# EAGLE design main (EAGLE 9.6.2)
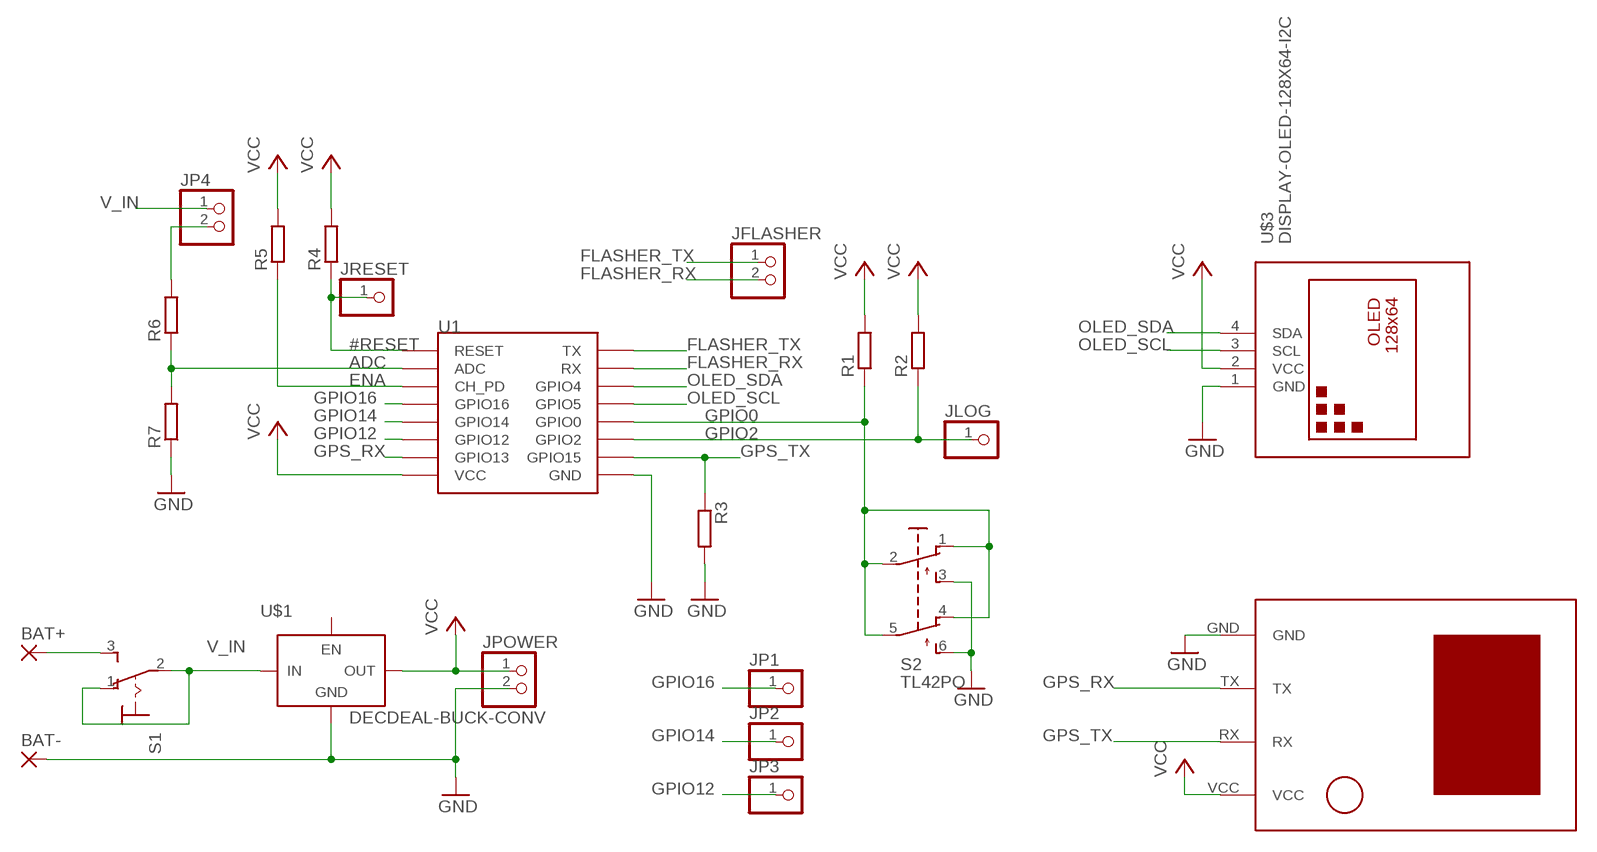
[diagram p0: schematic, sheet 1]

## Parts
BAT+  3,17/1,3  [3,17/1,3]
BAT-  3,17/1,3  [3,17/1,3]
JFLASHER  PINHD-1X2  [1X02]
JLOG  PINHD-1X1  [1X01]
JP1  PINHD-1X1  [1X01]
JP2  PINHD-1X1  [1X01]
JP3  PINHD-1X1  [1X01]
JP4  PINHD-1X2  [1X02]
JPOWER  PINHD-1X2  [1X02]
JRESET  PINHD-1X1  [1X01]
R1  R-EU_0207/10  [0207/10]
R2  R-EU_0207/10  [0207/10]
R3  R-EU_0309/V  [0309V]
R4  R-EU_0207/10  [0207/10]
R5  R-EU_0207/10  [0207/10]
R6  R-EU_0207/10  [0207/10]
R7  R-EU_0207/10  [0207/10]
S1  M9040P  [M9040P]
S2  TL42PO  [TL4XPO]
U1  ESP12  [ESP12]
U$1  DECDEAL-BUCK-CONV  [DECDEAL-BUCK-CONV]
U$2  U-BLOX-NEO6V2  [U-BLOX-NEO6V2]
U$3  DISPLAY-OLED-128X64-I2C  [DISPLAY-OLED-128X64-I2C]

## Nets
#RESET: JRESET.1 R4.1 U1.RESET
ADC: R6.1 R7.2 U1.ADC
BAT+: BAT+.1(P) S1.3(S)
ENA: R5.1 U1.CH_PD
FLASHER_RX: JFLASHER.2 U1.RX
FLASHER_TX: JFLASHER.1 U1.TX
GND: BAT-.1(P) JPOWER.2 R3.2 R7.1 S2.3(S) S2.6(S1) U1.GND U$1.GND U$2.GND U$3.1(GND)
GPIO0: R1.1 S2.1(O) S2.2(P) S2.4(O1) S2.5(P1) U1.GPIO0
GPIO2: JLOG.1 R2.1 U1.GPIO2
GPIO12: JP3.1 U1.GPIO12
GPIO14: JP2.1 U1.GPIO14
GPIO16: JP1.1 U1.GPIO16
GPS_RX: U1.GPIO13 U$2.TX
GPS_TX: R3.1 U1.GPIO15 U$2.RX
N$186: JP4.2 R6.2
OLED_SCL: U1.GPIO5 U$3.3(SCL)
OLED_SDA: U1.GPIO4 U$3.4(SDA)
V_IN: JP4.1 S1.1(O) S1.2(P) U$1.IN
VCC: JPOWER.1 R1.2 R2.2 R4.2 R5.2 U1.VCC U$1.OUT U$2.VCC U$3.2(VCC)
Unconnected: U$1.EN

## Library data of the parts
BAT+ BAT- = wirepad:3,17/1,3: THROUGH-HOLE PAD
JFLASHER JP4 JPOWER = pinhead:PINHD-1X2: PIN HEADER
JLOG JP1-JP3 JRESET = pinhead:PINHD-1X1: PIN HEADER
R1-R7 = rcl:R-EU_: RESISTOR, European symbol; SPICEPREFIX: R
S1 = switch:M9040P: TOGGLE SWITCH Marquardt
S2 = switch:TL42PO: TINY SWITCH ON - MOM Source: http://www2.produktinfo.conrad.com/datenblaetter/700000-724999/705152-da-01-de-Subminiaturschalter_TL_36YO.pdf
U1 = esp8266modules:ESP12: ESP8266 Wifi module 12
U$1 = gsimon75:DECDEAL-BUCK-CONV: DecDeal DC-DC Buck Converter (4.5 .. 24 V) to (1.8 .. 12 V) @ 3A Step-Down Power Module 97.5% Efficiency
U$2 = u-blox neo-6m v2:U-BLOX-NEO6V2
U$3 = diy-modules:DISPLAY-OLED-128X64-I2C: 128x64 Dot Matrix OLED Module based on SSD1306 chip Variant with I2C interface More details available here: http://www.instructables.com/id/Monochrome-096-i2c-OLED-display-with-arduino-SSD13/ SSD1306 datasheet: https://cdn-shop.adafruit.com/datasheets/SSD1306.pdf Click here to find device on ebay.com <http://www.ebay.com/sch/oled+display+128x64+iic> Note: There are two variants: I2C and SPI. Search for the proper version.

## Board
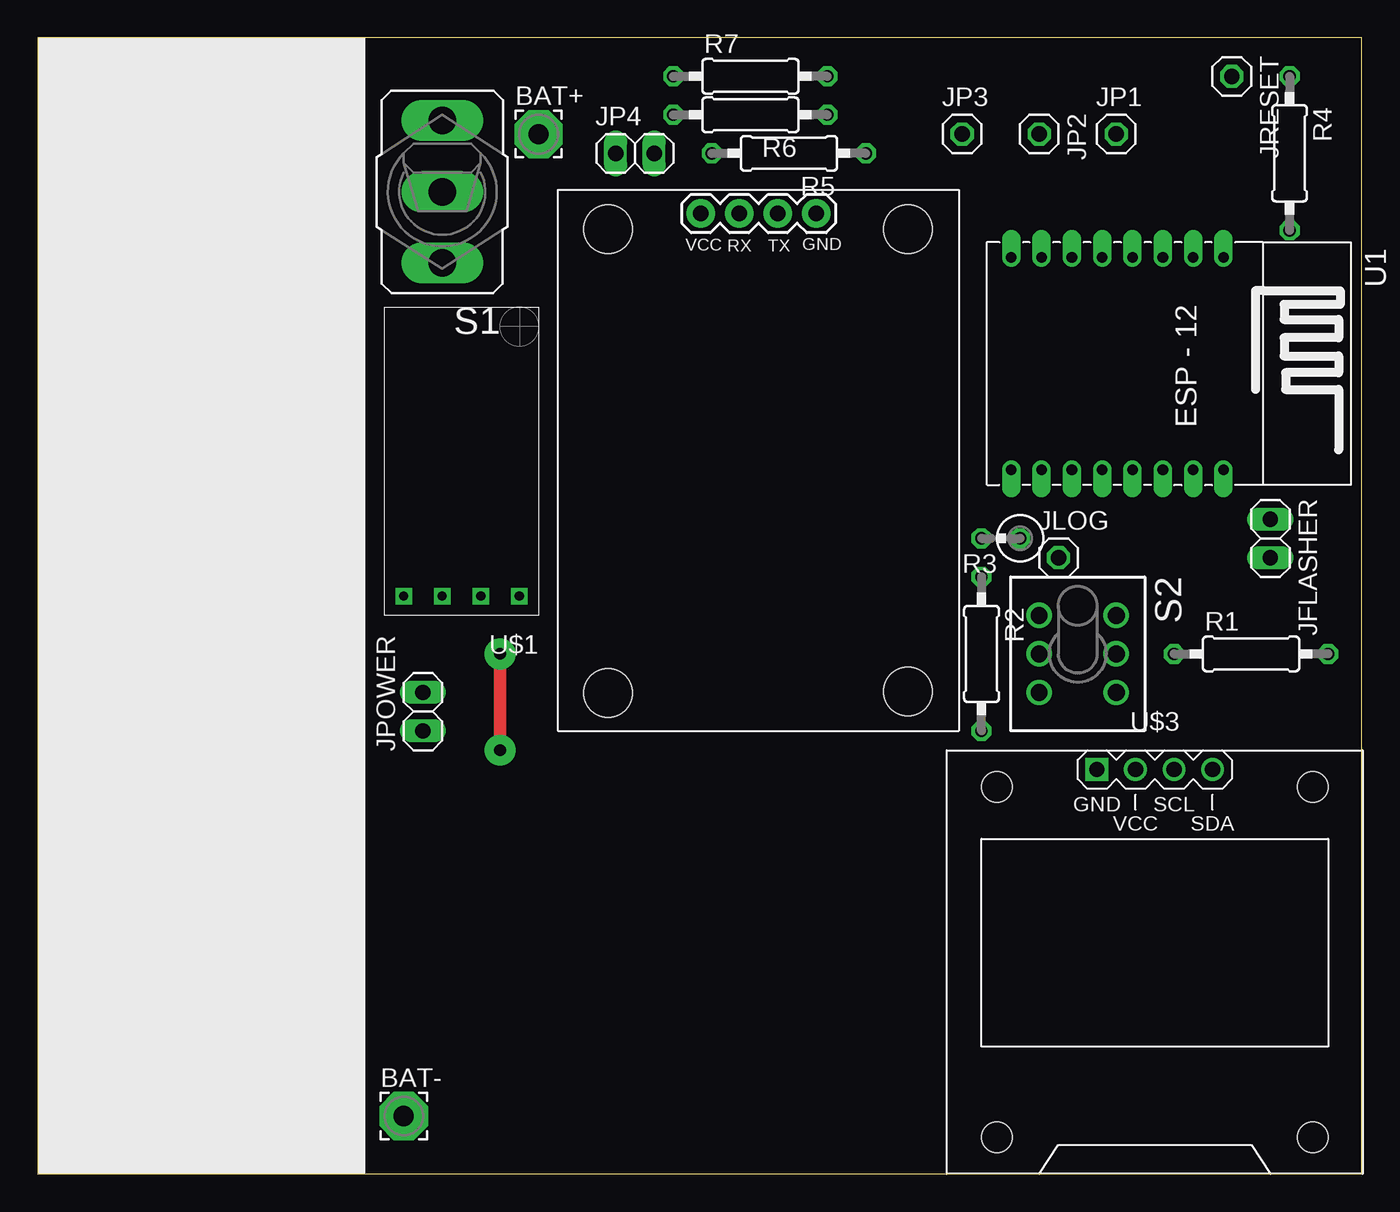
[diagram p1: board, top side]
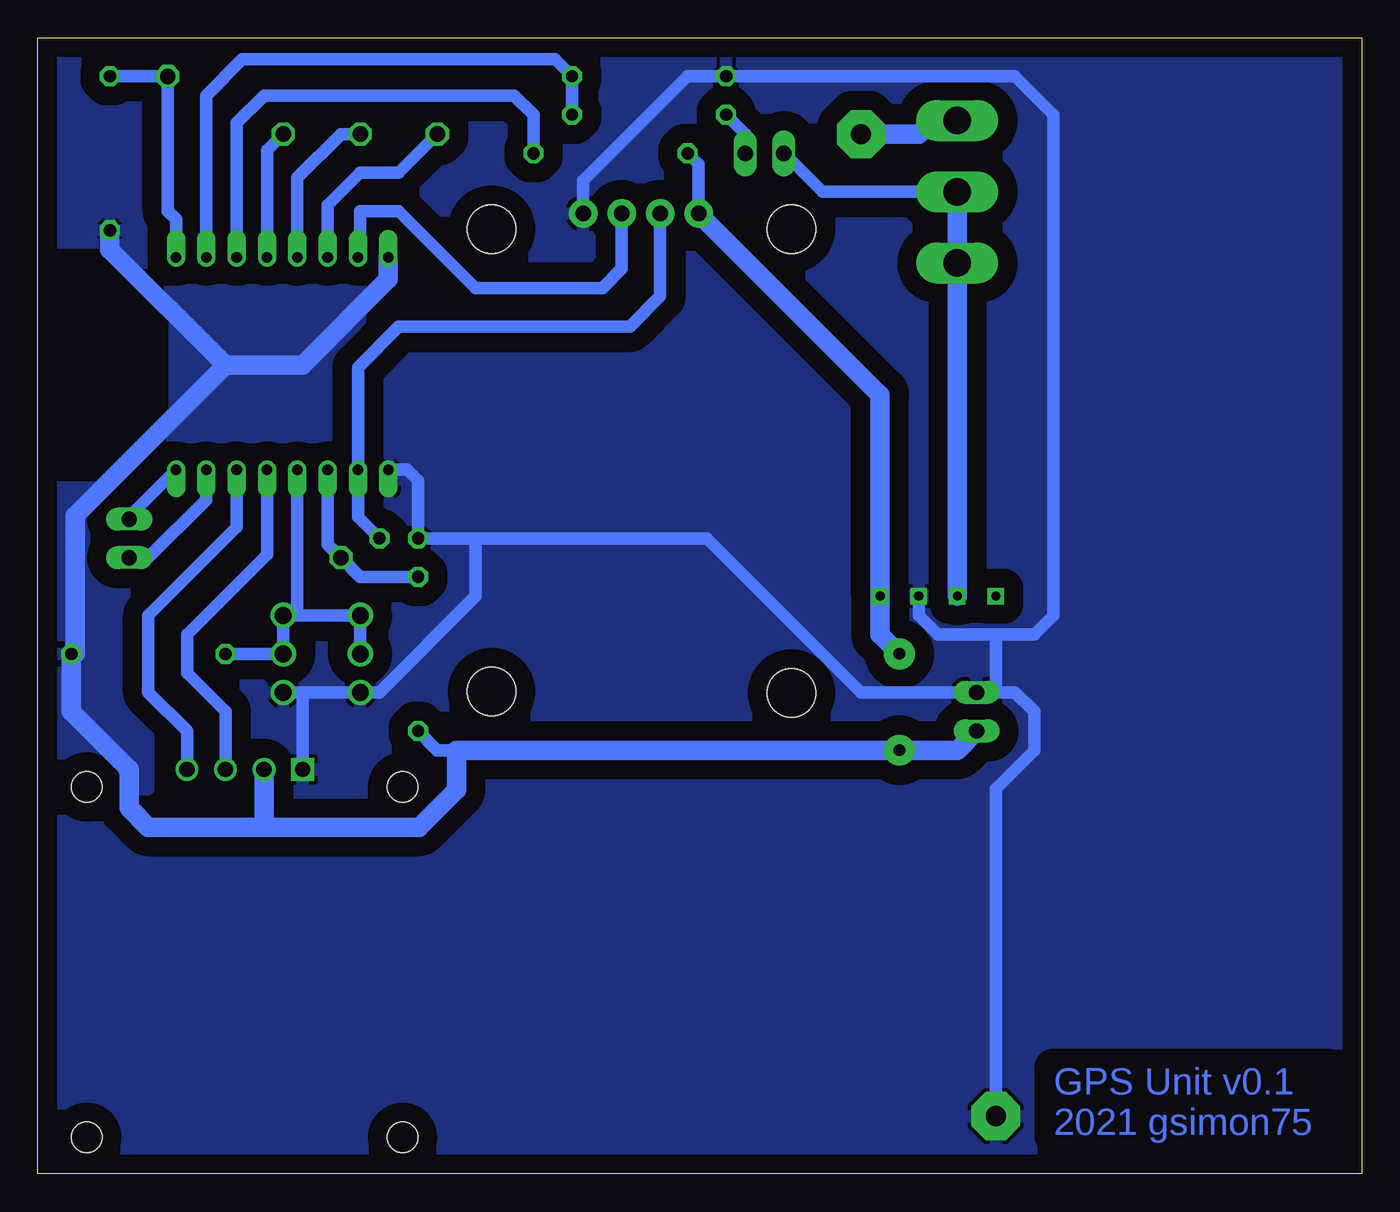
[diagram p2: board, bottom side, seen from below]

Size 87.3 x 74.92 mm. Coordinates in mm from the lower left corner, seen from the top.
Outline: 0,0 87.3,0 87.3,74.92 0,74.92 0,0
Copper layers (1*16): Top 0.035mm / dielectric 1.5mm / Bottom 0.035mm
Design rules "default *": minimum track width 6mil, minimum drill 0.35mm, track to track 6mil, track to pad 6mil, pad to pad 6mil, via to via 6mil, smd to smd 6mil, copper to edge 40mil, drill to drill 6mil, minimum pad ring 10mil, minimum via ring 8mil, stop-mask expansion 4mil, vias tented up to drill 0mil, thermal gap 10mil
bRestrict: area 80,47 to 86.4,59.7

### Footprints (pad centres in the part's own frame; a part is rotated, then mirrored left to right if it is on the bottom)
3,17/1,3 = drill 1.321 pad 3.175 octagon: 1 0,0
1X02 = drill 1.016 long: 1 -1.27,0; 2 1.27,0
1X01 = drill 1.016 octagon: 1 0,0
0207/10 = drill 0.813 octagon: 1 -5.08,0; 2 5.08,0
0309V = drill 0.813 octagon: 1 -1.27,0; 2 1.27,0
M9040P = drill 1.803 long: 1 0,4.699; 2 0,0; 3 0,-4.699
TL4XPO = drill 1.1 pad 1.676: 1 -2.54,2.54; 2 0,2.54; 3 2.54,2.54; 4 -2.54,-2.54; 5 0,-2.54; 6 2.54,-2.54
ESP12 = drill 0.7 offset: ADC -7.1,3.8; CH_PD -7.1,1.8; GND 6.9,-8.2; GPIO0 6.9,-2.2; GPIO2 6.9,-4.2; GPIO4 6.9,1.8; GPIO5 6.9,-0.2; GPIO12 -7.1,-4.2; GPIO13 -7.1,-6.2; GPIO14 -7.1,-2.2; GPIO15 6.9,-6.2; GPIO16 -7.1,-0.2; RESET -7.1,5.8; RX 6.9,3.8; TX 6.9,5.8; VCC -7.1,-8.2
DECDEAL-BUCK-CONV = drill 0.6 square: EN 3.81,8.89; GND -1.27,8.89; IN 1.27,8.89; OUT -3.81,8.89
U-BLOX-NEO6V2 = drill 1.016 pad 1.88: GND 17.05,34.13; RX 11.97,34.13; TX 14.51,34.13; VCC 9.43,34.13 | hole 3.2: 3.3,33.1; 23.1,33.1; 3.3,2.5; 23.1,2.6
DISPLAY-OLED-128X64-I2C = drill 1 square: 1 -3.81,12.7 | drill 1: 2 -1.27,12.7; 3 1.27,12.7; 4 3.81,12.7 | hole 2: -10.414,11.557; 10.414,11.557; 10.414,-11.557; -10.414,-11.557

### Placement (x,y rotation side)
BAT+  33.02,68.58 0 top
BAT-  24.13,3.81 0 top
JFLASHER  81.28,41.91 270 top
JLOG  67.31,40.64 0 top
JP1  71.12,68.58 0 top
JP2  66.04,68.58 270 top
JP3  60.96,68.58 0 top
JP4  39.37,67.31 0 top
JPOWER  25.4,30.48 90 top
JRESET  78.74,72.39 270 top
R1  80.01,34.29 0 top
R2  62.23,34.29 270 top
R3  63.5,41.91 180 top
R4  82.55,67.31 270 top
R5  49.53,67.31 180 top
R6  46.99,69.85 180 top
R7  46.99,72.39 0 top
S1  26.67,64.77 180 top
S2  68.58,34.29 270 top
U1  72.39,53.34 270 top
U$1  27.94,46.99 180 top
U$2  34.29,29.21 0 top
U$3  73.66,13.97 0 top

### Tracks (layer width: path | path; a pad name or v marks a point on that pad's centre or on a via)
#RESET
  Bottom 0.813: U1.RESET 78.19,62.95 78.74,63.5 JRESET.1 R4.1
ADC
  Bottom 0.813: R6.1 R7.2 53.18,73.5 73.81,73.5 76.2,71.11 76.2,64.77 76.19,64.76 U1.ADC
BAT+
  Bottom 1.27: BAT+.1 29.21,68.58 27.94,69.85 27.05,69.85 S1.3
ENA
  Bottom 0.813: R5.1 54.61,69.85 55.88,71.12 72.39,71.12 74.19,69.32 U1.CH_PD
FLASHER_RX
  Bottom 0.813: U1.RX 76.2,44.45 80.01,40.64 JFLASHER.2
FLASHER_TX
  Bottom 0.813: U1.TX 81.28,43.35 JFLASHER.1
GND
  Bottom 0.813: U$1.GND 29.21,36.83 27.94,35.56 24.13,35.56 | 24.13,31.75 JPOWER.2 33.02,31.75 43.18,41.91 58.42,41.91 | U$2.GND 51.34,65.5 44.45,72.39 R7.1 22.86,72.39 20.32,69.85 20.32,36.83 21.59,35.56 24.13,35.56 | 24.13,31.75 24.13,35.56 | U1.GND 62.95,46.44 62.23,45.72 R3.2 58.42,41.91 | BAT-.1 24.13,25.4 21.59,27.94 21.59,30.48 22.86,31.75 24.13,31.75 | U$3.1 69.85,31.75 | 69.85,31.75 S2.6 64.77,31.75 58.42,38.1 58.42,41.91 | S2.3 69.85,31.75
  pour Bottom (isolate 1.27, rank 6): 0,0 87.63,0 87.63,74.93 0,74.93
GPIO0
  Bottom 0.813: 70.19,36.83 S2.1 S2.2 R1.1 | 70.19,36.83 S2.4 S2.5 | U1.GPIO0 70.19,36.83
GPIO2
  Bottom 0.813: R2.1 66.04,39.37 JLOG.1 68.19,41.52 U1.GPIO2
GPIO12
  Bottom 0.813: U1.GPIO12 68.19,63.89 66.04,66.04 63.5,66.04 JP3.1
GPIO14
  Bottom 0.813: JP2.1 67.31,68.58 70.19,65.7 U1.GPIO14
GPIO16
  Bottom 0.813: U1.GPIO16 72.19,67.51 JP1.1
GPS_RX
  Bottom 0.813: U$2.TX 48.8,59.69 50.07,58.42 58.42,58.42 63.5,63.5 66.04,63.5 66.04,60.59 U1.GPIO13
GPS_TX
  Bottom 0.813: U$2.RX 46.26,57.88 48.26,55.88 63.5,55.88 66.19,53.19 U1.GPIO15 66.19,43.33 R3.1
N$186
  Bottom 0.813: R6.2 40.64,68.58 JP4.2
OLED_SCL
  Bottom 0.813: U1.GPIO5 72.19,40.84 77.47,35.56 77.47,33.02 74.93,30.48 U$3.3
OLED_SDA
  Bottom 0.813: U1.GPIO4 74.19,42.65 80.01,36.83 80.01,31.75 77.47,29.21 U$3.4
V_IN
  Bottom 0.813: JP4.1 35.56,64.77 S1.2
  Bottom 1.27: S1.2 S1.1 U$1.IN
VCC  (via drill 0.76 pad 2.03)
  Top 0.813: v30.48,34.29 v30.48,27.94
  Bottom 0.813: R5.2 43.72,66.58 U$2.VCC | R2.2 60.96,27.94 59.69,27.94 | R1.2 84.85,34.29
  Bottom 1.27: U$2.VCC 31.75,51.37 U$1.OUT 31.75,35.56 v30.48,34.29 | U1.VCC 64.19,59 69.85,53.34 74.93,53.34 | JPOWER.1 26.67,27.94 v30.48,27.94 59.69,27.94 59.69,25.33 62.16,22.86 72.39,22.86 | 84.85,34.29 84.85,43.42 74.93,53.34 | R4.2 82.55,60.96 74.93,53.34 | U$3.2 72.39,22.86 | R1.2 85.09,30.48 81.28,26.67 81.28,24.13 80.01,22.86 72.39,22.86
  pour Bottom (isolate 1.27): 80.01,25.4 87.63,25.4 87.63,74.93 78.74,74.93 78.74,60.96 66.04,60.96 66.04,45.72 80.01,45.72

### Text on the board
Bottom: GPS Unit v0.1 / 2021 gsimon75